# Altium schematic sheet Senser.SchDoc
size A4; SheetNumber: 4; SheetTotal: 5
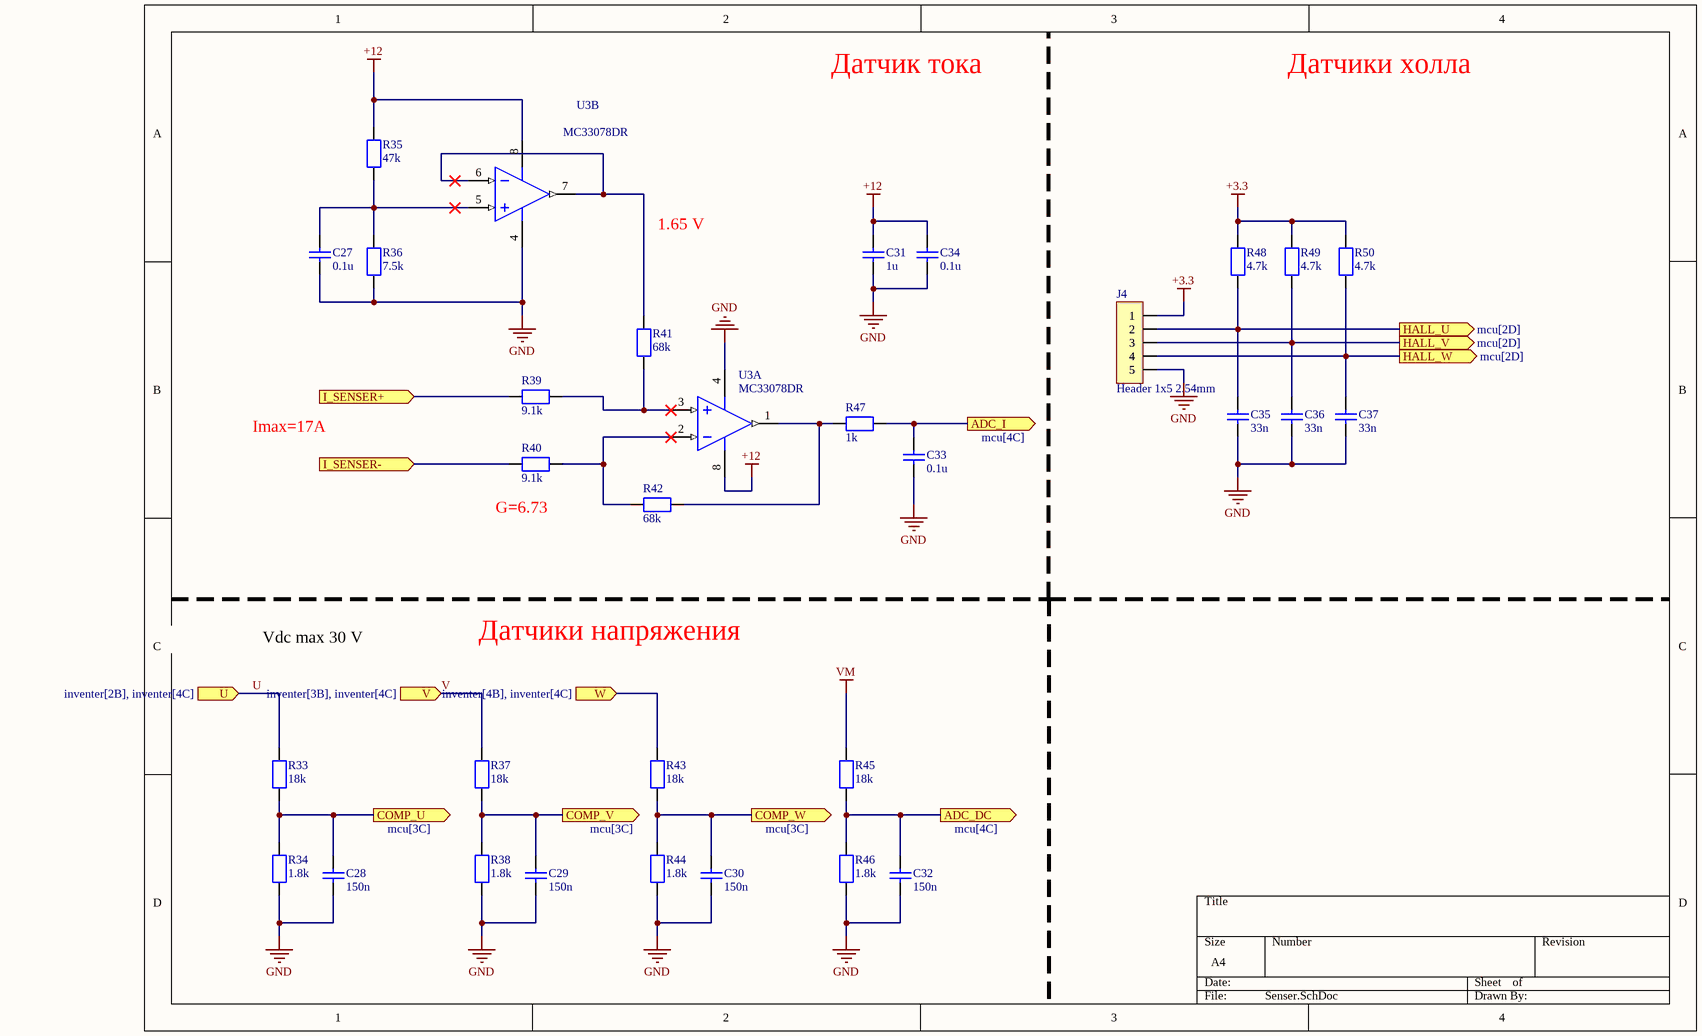
[diagram p0: Senser.SchDoc]

## Parts
C27  value 0.1u  [CAPC2012X06N]  (hidden comment: CAP)
C28  value 150n  [CAPC2012X06N]  (hidden comment: CAP)
C29  value 150n  [CAPC2012X06N]  (hidden comment: CAP)
C30  value 150n  [CAPC2012X06N]  (hidden comment: CAP)
C31  value 1u  [CAPC2012X06N]  (hidden comment: CAP)
C32  value 150n  [CAPC2012X06N]  (hidden comment: CAP)
C33  value 0.1u  [CAPC2012X06N]  (hidden comment: CAP)
C34  value 0.1u  [CAPC2012X06N]  (hidden comment: CAP)
C35  value 33n  [CAPC2012X06N]  (hidden comment: CAP)
C36  value 33n  [CAPC2012X06N]  (hidden comment: CAP)
C37  value 33n  [CAPC2012X06N]  (hidden comment: CAP)
J4  Header 1x5 2.54mm  [Header 1x5 2.54mm]
R33  value 18k  [RESC2012X06N]  (hidden comment: Resistor)
R34  value 1.8k  [RESC2012X06N]  (hidden comment: Resistor)
R35  value 47k  [RESC2012X06N]  (hidden comment: Resistor)
R36  value 7.5k  [RESC2012X06N]  (hidden comment: Resistor)
R37  value 18k  [RESC2012X06N]  (hidden comment: Resistor)
R38  value 1.8k  [RESC2012X06N]  (hidden comment: Resistor)
R39  value 9.1k  [RESC2012X06N]  (hidden comment: Resistor)
R40  value 9.1k  [RESC2012X06N]  (hidden comment: Resistor)
R41  value 68k  [RESC2012X06N]  (hidden comment: Resistor)
R42  value 68k  [RESC2012X06N]  (hidden comment: Resistor)
R43  value 18k  [RESC2012X06N]  (hidden comment: Resistor)
R44  value 1.8k  [RESC2012X06N]  (hidden comment: Resistor)
R45  value 18k  [RESC2012X06N]  (hidden comment: Resistor)
R46  value 1.8k  [RESC2012X06N]  (hidden comment: Resistor)
R47  value 1k  [RESC2012X06N]  (hidden comment: Resistor)
R48  value 4.7k  [RESC2012X06N]  (hidden comment: Resistor)
R49  value 4.7k  [RESC2012X06N]  (hidden comment: Resistor)
R50  value 4.7k  [RESC2012X06N]  (hidden comment: Resistor)
U3  MC33078DR  [D0008A_L]  (parts A,B of 2)

## Ports
ADC_DC (out, see mcu[4C]), ADC_I (out, see mcu[4C]), COMP_U (out, see mcu[3C]), COMP_V (out, see mcu[3C]), COMP_W (out, see mcu[3C]), HALL_U (out, see mcu[2D]), HALL_V (out, see mcu[2D]), HALL_W (out, see mcu[2D]), I_SENSER+ (in, see inventer[2C]), I_SENSER- (in, see inventer[2C]), U (in, see inventer[2B], inventer[4C]), V (in, see inventer[3B], inventer[4C]), W (in, see inventer[4B], inventer[4C])

## Nets
+3.3: J4.1 R48.2 R49.2 R50.2
+12: C31.1 C34.1 R35.2 U3.8(VCC+)
GND: C27.2 C28.2 C29.2 C30.2 C31.2 C32.2 C33.2 C34.2 C35.2 C36.2 C37.2 J4.5 R34.1 R36.1 R38.1 R44.1 R46.1 U3.4(VCC-)
VM: R45.2
ADC_DC: C32.1 R45.1 R46.2 ; port ADC_DC
ADC_I: C33.1 R47.2 ; port ADC_I
COMP_U: C28.1 R33.1 R34.2 ; port COMP_U
COMP_V: C29.1 R37.1 R38.2 ; port COMP_V
COMP_W: C30.1 R43.1 R44.2 ; port COMP_W
HALL_U: C35.1 J4.2 R48.1 ; port HALL_U
HALL_V: C36.1 J4.3 R49.1 ; port HALL_V
HALL_W: C37.1 J4.4 R50.1 ; port HALL_W
I_SENSER+: R39.1 ; port I_SENSER+
I_SENSER-: R40.1 ; port I_SENSER-
U: R33.2 ; port U
V: R37.2 ; port V
W: R43.2 ; port W
NetC27_1: C27.1 R35.1 R36.2 U3.5(IN2+)
NetR39_2: R39.2 R41.1 U3.3(IN1+)
NetR40_2: R40.2 R42.2 U3.2(IN1-)
NetR41_2: R41.2 U3.6(IN2-) U3.7(OUT2)
NetR42_1: R42.1 R47.1 U3.1(OUT1)

## Notes on the sheet
- Датчик тока
- Датчики холла
- 1.65 V
- Imax=17A
- (near R40) G=6.73
- Vdc max 30 V
- Датчики напряжения

## Library data of the parts
C27 C34 = CAP: Конденсатор керамический smd 0.1 мкФ X7R 50В 10% 0805; Source: *
C28-C30 C32 = CAP: Конденсатор керамический smd 0.15мкФ X7R 50В 10% 0805; Source: *
C31 = CAP: Конденсатор керамический smd 1 мкФ X7R 10% 50В 0805; Source: *
C33 = CAP: Конденсатор керамический smd 0.01 мкФ NPO 50В 5%; Source: *
C35-C37 = CAP: Конденсатор керамический smd 0.033мкФ X7R 50В 10% 0805; Source: *
J4 = Header 1x5: PLS-5 (DS1021-1x5), Вилка штыревая 2.54мм 1x5pin
R33 R37 R43 R45 = Resistor: 0.125Вт 0805 12 кОм, 1%; Source: *
R34 R38 R44 R46 = Resistor: 0.125Вт 0805 1.5 кОм, 1%; Source: *
R35 = Resistor: 0.125Вт 0805 47 кОм, 1%; Source: *
R36 = Resistor: 0.125Вт 0805 7.5 кОм, 1%; Source: *
R39 R40 = Resistor: 0.125Вт 0805 9.1 кОм, 1%; Source: *
R41 R42 = Resistor: 0.125Вт 0805 68 кОм, 1%; Source: *
R47 = Resistor: 0.125Вт 0805 1 кОм, 1%; Source: *
R48-R50 = Resistor: 0.125Вт 0805 4.7 кОм, 1%; Source: *
U3 = CMP-0017-00420-2: Dual High-Speed Low-Noise Operational Amplifier, 10 to 36 V, -40 to 85 degC, 8-pin SOIC (D8), Green (RoHS & no Sb/Br); Manufacturer: Texas Instruments; Total Supply Voltage(Min)(+5V is 5, +/-5V is 10): 10; Slew Rate(Typ)(V/us): 7; Offset Drift(Typ)(uV/C): 2; CMRR(Min)(dB): 80; Sub Family: General Purpose Amplifier, High Supply Voltage Amplifier (>=30V), Low Noise Amp (<=10nV/rtHz); GBW(Typ)(MHz): 16; Iq per channel(Max)(mA): 2.5; Vn at 1kHz(Typ)(nV/rtHz): 4.5; Total Supply Voltage(Max)(+5V is 5, +/-5V is 10): 36; Rating: Catalog; IIB(Max)(pA): 750000; ComponentLink1URL: http://www.ti.com/; ComponentLink2Description: Datasheet; ComponentLink3URL: http://www.ti.com/litv/pdf/msoi002j; Number of Channels: 2; Mounting Technology: Surface Mount; Vio (25C)(Max)(mV): 2; DatasheetVersion: SLLS633C; PackageDescription: 8-Pin Plastic Small Outline, Body 4.9 x 3.9 mm, Pitch 1.27 mm; Eco-Plan: Green (RoHS & no Sb/Br); ComponentLink1Description: Manufacturer URL; PackageVersion: 4040047-3/M, 06/2011; ComponentLink3Description: Package Specification; PackageReference: D0008A; PartNumber: MC33078DR; Code_JEDEC: MS-012; ComponentLink2URL: http://www.ti.com/lit/ds/symlink/mc33078.pdf